# Altium schematic sheet IsolationBarriers.SchDoc
size A4; SheetNumber: 8; SheetTotal: 9
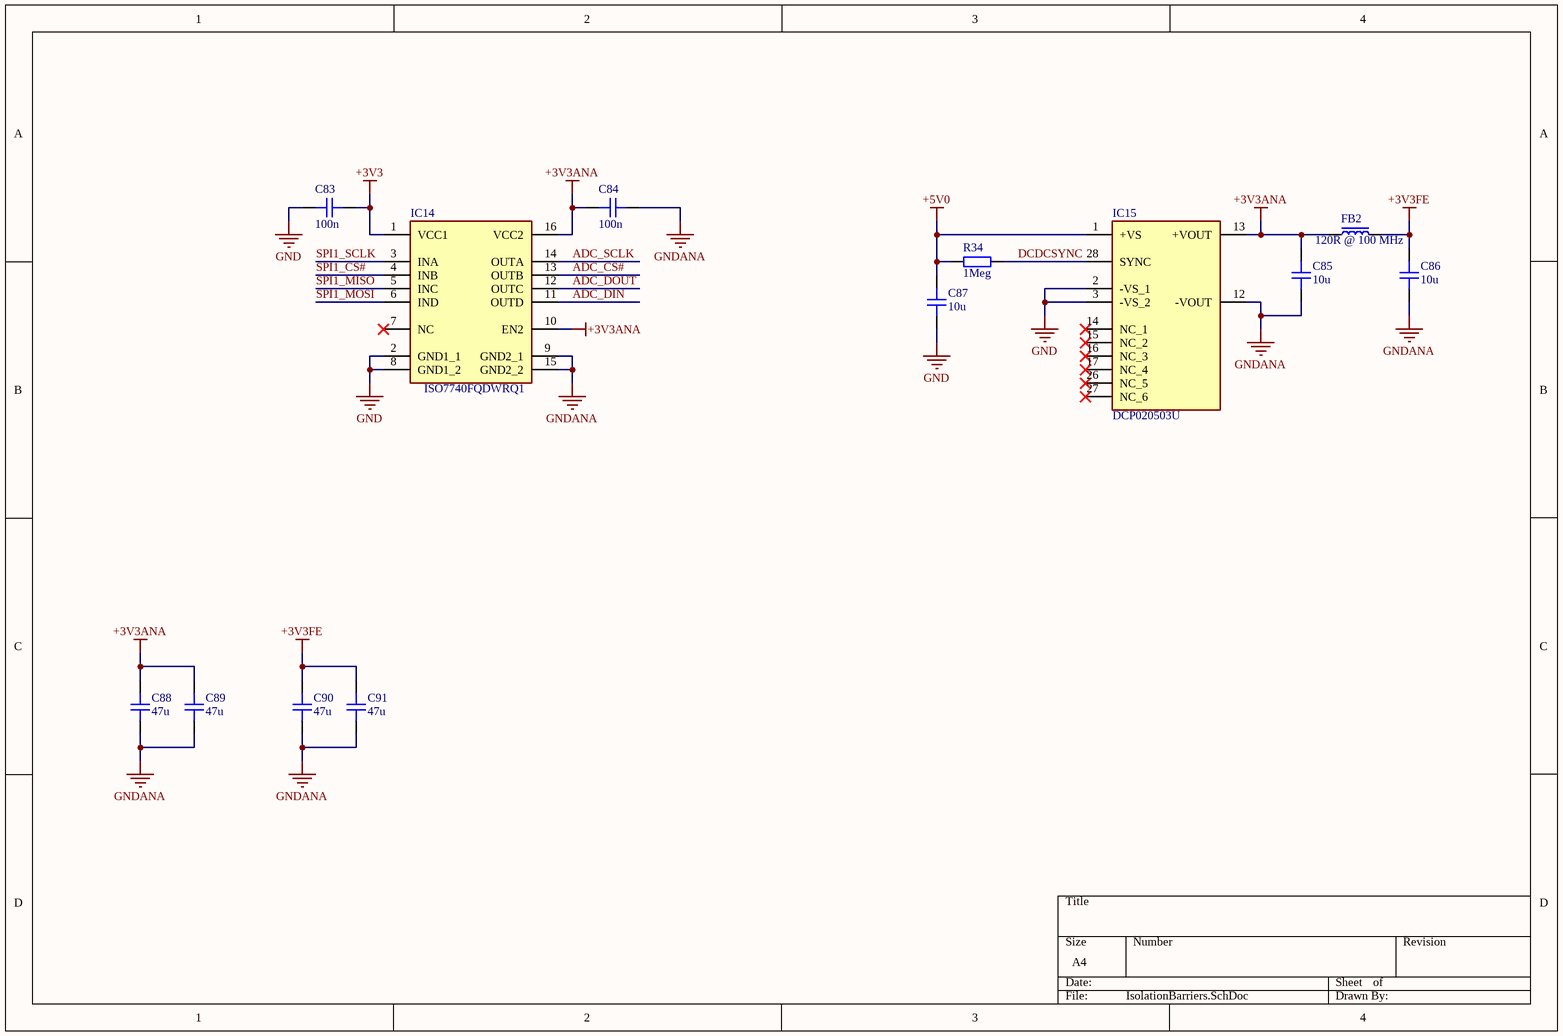
[diagram p0: IsolationBarriers.SchDoc]

## Parts
C83  100n  [CAP_0402]
C84  100n  [CAP_0402]
C85  10u  [CAP_0603]
C86  10u  [CAP_0603]
C87  10u  [CAP_0603]
C88  47u  [CAP_1210]
C89  47u  [CAP_1210]
C90  47u  [CAP_1210]
C91  47u  [CAP_1210]
FB2  120R @ 100 MHz  [FB_0603]
IC14  ISO7740FQDWRQ1  [SOIC127P1030X265-16N]
IC15  DCP020503U  [DVB0012A]
R34  1Meg  [RES_0402]

## Nets
+3V3: C83.1 IC14.1(VCC1)
+3V3ANA: C84.2 C85.2 C88.2 C89.2 FB2.1 IC14.10(EN2) IC14.16(VCC2) IC15.13(+VOUT)
+3V3FE: C86.2 C90.2 C91.2 FB2.2
+5V0: C87.2 IC15.1(+VS) R34.1
GND: C83.2 C87.1 IC14.2(GND1_1) IC14.8(GND1_2) IC15.2(-VS_1) IC15.3(-VS_2)
GNDANA: C84.1 C85.1 C86.1 C88.1 C89.1 C90.1 C91.1 IC14.9(GND2_1) IC14.15(GND2_2) IC15.12(-VOUT)
ADC_CS#: IC14.13(OUTB)
ADC_DIN: IC14.11(OUTD)
ADC_DOUT: IC14.12(OUTC)
ADC_SCLK: IC14.14(OUTA)
DCDCSYNC: IC15.28(SYNC) R34.2
SPI1_CS#: IC14.4(INB)
SPI1_MISO: IC14.5(INC)
SPI1_MOSI: IC14.6(IND)
SPI1_SCLK: IC14.3(INA)

Not connected (* = marked no-connect by the designer): IC14 7(NC)*; IC15 14(NC_1)* 15(NC_2)* 16(NC_3)* 17(NC_4)* 26(NC_5)* 27(NC_6)*

## Library data of the parts
C83 C84 = CAP_0402: Capacitor SMD 0402; Manufacturer: *; Manufacturer Part Number: *; Distributor Link: *; LCSC: *; Rating: *; Dielectric: *
C85-C87 = CAP_0603: Capacitor SMD 0603; Manufacturer: *; Manufacturer Part Number: *; Distributor Link: *; LCSC: *; Rating: *; Dielectric: *
C88-C91 = CAP_1210: Capacitor SMD 1210; Manufacturer: *; Manufacturer Part Number: *; Distributor Link: *; LCSC: *; Rating: *; Dielectric: *
FB2 = FB_0603: Ferrite Bead SMD 0603; Manufacturer: *; Manufacturer Part Number: *; Distributor Link: *; LCSC: *
IC14 = ISO7740FQDWRQ1: Integrated Circuit; Manufacturer_Name: Texas Instruments; Datasheet Link: https://www.ti.com/lit/gpn/iso7740-q1; Height: 2.65mm; Manufacturer_Part_Number: ISO7740FQDWRQ1; Mouser Part Number: 595-ISO7740FQDWRQ1; Mouser Price/Stock: https://www.mouser.co.uk/ProductDetail/Texas-Instruments/ISO7740FQDWRQ1?qs=34RfhUjJmKfM2MieHZI64w%3D%3D; Arrow Part Number: ISO7740FQDWRQ1; Arrow Price/Stock: https://www.arrow.com/en/products/iso7740fqdwrq1/texas-instruments?utm_currency=USD&region=nac
IC15 = DCP020503U: TI Isolated DC DC Converter; Manufacturer_Name: Texas Instruments; Datasheet Link: http://www.ti.com/lit/gpn/dcp020503; Manufacturer_Part_Number: DCP020503U; Mouser Part Number: 595-DCP020503U; Mouser Price/Stock: https://www.mouser.com/Search/Refine.aspx?Keyword=595-DCP020503U; Arrow Part Number: DCP020503U; Arrow Price/Stock: https://www.arrow.com/en/products/dcp020503u/texas-instruments
R34 = RES_0402: Resistor SMD 0402; Manufacturer: *; Manufacturer Part Number: *; Distributor Link: *; LCSC: *